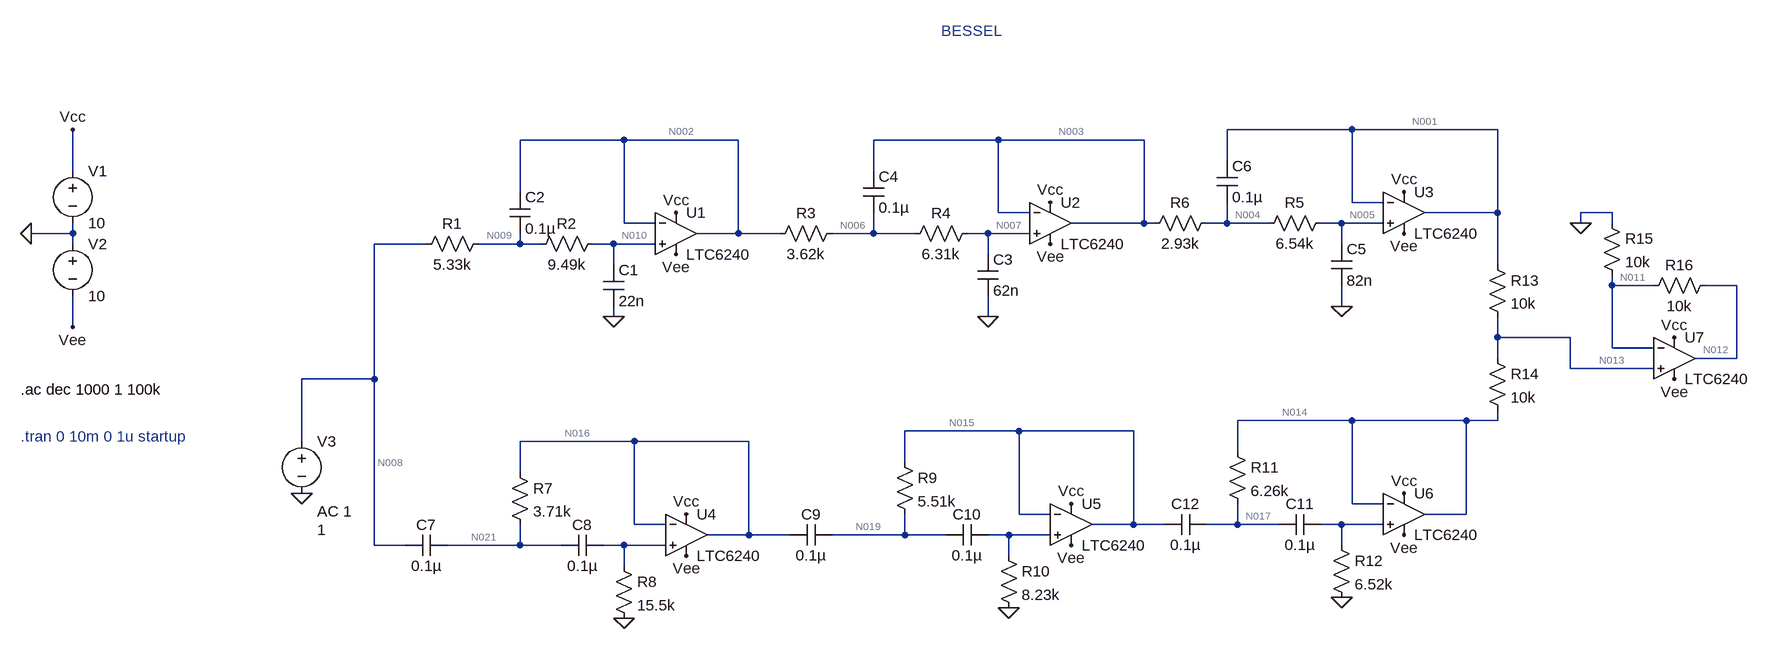
[diagram p0: schematic eq filtering.asc]
eq filtering.asc, the LTspice schematic file:
Version 4
SHEET 1 1800 1780
WIRE 1184 0 992 0
WIRE 1408 0 1184 0
WIRE 64 16 -96 16
WIRE 240 16 64 16
WIRE 640 16 448 16
WIRE 864 16 640 16
WIRE 992 48 992 0
WIRE -784 64 -784 0
WIRE 448 64 448 16
WIRE -96 96 -96 16
WIRE 1184 112 1184 0
WIRE 1232 112 1184 112
WIRE 640 128 640 16
WIRE 688 128 640 128
WIRE 1408 128 1408 0
WIRE 1408 128 1296 128
WIRE 1584 128 1536 128
WIRE 64 144 64 16
WIRE 112 144 64 144
WIRE 864 144 864 16
WIRE 864 144 752 144
WIRE 880 144 864 144
WIRE 992 144 992 112
WIRE 992 144 960 144
WIRE 1056 144 992 144
WIRE 1168 144 1136 144
WIRE 1232 144 1168 144
WIRE 1536 144 1536 128
WIRE 1584 144 1584 128
WIRE -784 160 -784 144
WIRE -784 160 -848 160
WIRE 240 160 240 16
WIRE 240 160 176 160
WIRE 304 160 240 160
WIRE 448 160 448 128
WIRE 448 160 384 160
WIRE 512 160 448 160
WIRE 624 160 592 160
WIRE 688 160 624 160
WIRE -784 176 -784 160
WIRE -240 176 -320 176
WIRE -96 176 -96 160
WIRE -96 176 -160 176
WIRE -64 176 -96 176
WIRE 48 176 16 176
WIRE 112 176 48 176
WIRE 1168 176 1168 144
WIRE 624 192 624 160
WIRE 48 208 48 176
WIRE 1408 208 1408 128
WIRE 1584 240 1584 224
WIRE 1648 240 1584 240
WIRE 1776 240 1728 240
WIRE 1168 272 1168 240
WIRE 48 288 48 272
WIRE 624 288 624 256
WIRE -784 304 -784 256
WIRE 1408 320 1408 288
WIRE 1520 320 1408 320
WIRE 1584 336 1584 240
WIRE 1648 336 1584 336
WIRE 1408 352 1408 320
WIRE 1776 352 1776 240
WIRE 1776 352 1712 352
WIRE 1520 368 1520 320
WIRE 1648 368 1520 368
WIRE -320 384 -320 176
WIRE -320 384 -432 384
WIRE 1184 448 1008 448
WIRE 1360 448 1184 448
WIRE 1408 448 1408 432
WIRE 1408 448 1360 448
WIRE 672 464 496 464
WIRE 848 464 672 464
WIRE -432 480 -432 384
WIRE 80 480 -96 480
WIRE 256 480 80 480
WIRE 1008 496 1008 448
WIRE 496 512 496 464
WIRE -96 528 -96 480
WIRE 1184 576 1184 448
WIRE 1232 576 1184 576
WIRE 672 592 672 464
WIRE 720 592 672 592
WIRE 1360 592 1360 448
WIRE 1360 592 1296 592
WIRE 80 608 80 480
WIRE 128 608 80 608
WIRE 848 608 848 464
WIRE 848 608 784 608
WIRE 896 608 848 608
WIRE 1008 608 1008 576
WIRE 1008 608 960 608
WIRE 1072 608 1008 608
WIRE 1168 608 1136 608
WIRE 1232 608 1168 608
WIRE 256 624 256 480
WIRE 256 624 192 624
WIRE 320 624 256 624
WIRE 496 624 496 592
WIRE 496 624 384 624
WIRE 560 624 496 624
WIRE 656 624 624 624
WIRE 720 624 656 624
WIRE -320 640 -320 384
WIRE -272 640 -320 640
WIRE -96 640 -96 608
WIRE -96 640 -208 640
WIRE -32 640 -96 640
WIRE 64 640 32 640
WIRE 128 640 64 640
WIRE 1168 640 1168 608
WIRE 656 656 656 624
WIRE 64 672 64 640
FLAG -848 160 0
FLAG -784 304 Vee
FLAG -784 0 Vcc
FLAG 144 192 Vee
FLAG 144 128 Vcc
FLAG 48 288 0
FLAG 720 176 Vee
FLAG 720 112 Vcc
FLAG 624 288 0
FLAG 1264 160 Vee
FLAG 1264 96 Vcc
FLAG 1168 272 0
FLAG 160 656 Vee
FLAG 160 592 Vcc
FLAG -432 560 0
FLAG 64 752 0
FLAG 752 640 Vee
FLAG 752 576 Vcc
FLAG 656 736 0
FLAG 1264 624 Vee
FLAG 1264 560 Vcc
FLAG 1168 720 0
FLAG 1680 384 Vee
FLAG 1680 320 Vcc
FLAG 1536 144 0
SYMBOL OpAmps\\LTC6240 144 160 R0
SYMATTR InstName U1
SYMBOL voltage -784 48 R0
WINDOW 123 0 0 Left 0
WINDOW 39 0 0 Left 0
SYMATTR InstName V1
SYMATTR Value 10
SYMBOL voltage -784 160 R0
WINDOW 123 0 0 Left 0
WINDOW 39 0 0 Left 0
SYMATTR InstName V2
SYMATTR Value 10
SYMBOL res -144 160 R90
WINDOW 0 0 56 VBottom 2
WINDOW 3 32 56 VTop 2
SYMATTR InstName R1
SYMATTR Value 5.33k
SYMBOL res 32 160 R90
WINDOW 0 0 56 VBottom 2
WINDOW 3 32 56 VTop 2
SYMATTR InstName R2
SYMATTR Value 9.49k
SYMBOL cap 32 208 R0
SYMATTR InstName C1
SYMATTR Value 22n
SYMBOL cap -112 96 R0
SYMATTR InstName C2
SYMATTR Value 0.1µ
SYMBOL OpAmps\\LTC6240 720 144 R0
SYMATTR InstName U2
SYMBOL res 400 144 R90
WINDOW 0 0 56 VBottom 2
WINDOW 3 32 56 VTop 2
SYMATTR InstName R3
SYMATTR Value 3.62k
SYMBOL res 608 144 R90
WINDOW 0 0 56 VBottom 2
WINDOW 3 32 56 VTop 2
SYMATTR InstName R4
SYMATTR Value 6.31k
SYMBOL cap 608 192 R0
SYMATTR InstName C3
SYMATTR Value 62n
SYMBOL cap 432 64 R0
SYMATTR InstName C4
SYMATTR Value 0.1µ
SYMBOL OpAmps\\LTC6240 1264 128 R0
SYMATTR InstName U3
SYMBOL res 1152 128 R90
WINDOW 0 0 56 VBottom 2
WINDOW 3 32 56 VTop 2
SYMATTR InstName R5
SYMATTR Value 6.54k
SYMBOL cap 1152 176 R0
SYMATTR InstName C5
SYMATTR Value 82n
SYMBOL cap 976 48 R0
SYMATTR InstName C6
SYMATTR Value 0.1µ
SYMBOL res 976 128 R90
WINDOW 0 0 56 VBottom 2
WINDOW 3 32 56 VTop 2
SYMATTR InstName R6
SYMATTR Value 2.93k
SYMBOL OpAmps\\LTC6240 160 624 R0
SYMATTR InstName U4
SYMBOL voltage -432 464 R0
WINDOW 3 24 152 Left 2
WINDOW 123 24 124 Left 2
WINDOW 39 0 0 Left 0
SYMATTR InstName V3
SYMATTR Value 1
SYMATTR Value2 AC 1
SYMBOL cap -208 624 R90
WINDOW 0 0 32 VBottom 2
WINDOW 3 32 32 VTop 2
SYMATTR InstName C7
SYMATTR Value 0.1µ
SYMBOL cap 32 624 R90
WINDOW 0 0 32 VBottom 2
WINDOW 3 32 32 VTop 2
SYMATTR InstName C8
SYMATTR Value 0.1µ
SYMBOL res -112 512 R0
SYMATTR InstName R7
SYMATTR Value 3.71k
SYMBOL res 48 656 R0
SYMATTR InstName R8
SYMATTR Value 15.5k
SYMBOL OpAmps\\LTC6240 752 608 R0
SYMATTR InstName U5
SYMBOL cap 384 608 R90
WINDOW 0 0 32 VBottom 2
WINDOW 3 32 32 VTop 2
SYMATTR InstName C9
SYMATTR Value 0.1µ
SYMBOL cap 624 608 R90
WINDOW 0 0 32 VBottom 2
WINDOW 3 32 32 VTop 2
SYMATTR InstName C10
SYMATTR Value 0.1µ
SYMBOL res 480 496 R0
SYMATTR InstName R9
SYMATTR Value 5.51k
SYMBOL res 640 640 R0
SYMATTR InstName R10
SYMATTR Value 8.23k
SYMBOL OpAmps\\LTC6240 1264 592 R0
SYMATTR InstName U6
SYMBOL cap 1136 592 R90
WINDOW 0 0 32 VBottom 2
WINDOW 3 32 32 VTop 2
SYMATTR InstName C11
SYMATTR Value 0.1µ
SYMBOL res 992 480 R0
SYMATTR InstName R11
SYMATTR Value 6.26k
SYMBOL res 1152 624 R0
SYMATTR InstName R12
SYMATTR Value 6.52k
SYMBOL cap 960 592 R90
WINDOW 0 0 32 VBottom 2
WINDOW 3 32 32 VTop 2
SYMATTR InstName C12
SYMATTR Value 0.1µ
SYMBOL OpAmps\\LTC6240 1680 352 R0
SYMATTR InstName U7
SYMBOL res 1392 192 R0
SYMATTR InstName R13
SYMATTR Value 10k
SYMBOL res 1392 336 R0
SYMATTR InstName R14
SYMATTR Value 10k
SYMBOL res 1568 128 R0
SYMATTR InstName R15
SYMATTR Value 10k
SYMBOL res 1744 224 R90
WINDOW 0 0 56 VBottom 2
WINDOW 3 32 56 VTop 2
SYMATTR InstName R16
SYMATTR Value 10k
TEXT -864 400 Left 2 !.ac dec 1000 1 100k
TEXT 552 -152 Left 2 ;BESSEL
TEXT -864 472 Left 2 ;.tran 0 10m 0 1u startup

The netlist it stands for:
* eq filtering.asc
* U1: LTC6240 (symbol OpAmps\LTC6240 not available, pins judged from their places): In+=N010 In-=N002 V+=Vcc V-=Vee OUT=N002
V1 Vcc 0 10
V2 0 Vee 10
R1 N009 N008 5.33k
R2 N010 N009 9.49k
C1 N010 0 22n
C2 N002 N009 0.1µ
* U2: LTC6240 (symbol OpAmps\LTC6240 not available, pins judged from their places): In+=N007 In-=N003 V+=Vcc V-=Vee OUT=N003
R3 N006 N002 3.62k
R4 N007 N006 6.31k
C3 N007 0 62n
C4 N003 N006 0.1µ
* U3: LTC6240 (symbol OpAmps\LTC6240 not available, pins judged from their places): In+=N005 In-=N001 V+=Vcc V-=Vee OUT=N001
R5 N005 N004 6.54k
C5 N005 0 82n
C6 N001 N004 0.1µ
R6 N004 N003 2.93k
* U4: LTC6240 (symbol OpAmps\LTC6240 not available, pins judged from their places): In+=N022 In-=N016 V+=Vcc V-=Vee OUT=N016
V3 N008 0 1 AC 1
C7 N021 N008 0.1µ
C8 N022 N021 0.1µ
R7 N016 N021 3.71k
R8 N022 0 15.5k
* U5: LTC6240 (symbol OpAmps\LTC6240 not available, pins judged from their places): In+=N020 In-=N015 V+=Vcc V-=Vee OUT=N015
C9 N019 N016 0.1µ
C10 N020 N019 0.1µ
R9 N015 N019 5.51k
R10 N020 0 8.23k
* U6: LTC6240 (symbol OpAmps\LTC6240 not available, pins judged from their places): In+=N018 In-=N014 V+=Vcc V-=Vee OUT=N014
C11 N018 N017 0.1µ
R11 N014 N017 6.26k
R12 N018 0 6.52k
C12 N017 N015 0.1µ
* U7: LTC6240 (symbol OpAmps\LTC6240 not available, pins judged from their places): In+=N013 In-=N011 V+=Vcc V-=Vee OUT=N012
R13 N001 N013 10k
R14 N013 N014 10k
R15 0 N011 10k
R16 N012 N011 10k
.ac dec 1000 1 100k
* BESSEL
* .tran 0 10m 0 1u startup
.backanno
.end

* Results of the author's LTspice run, read from the files saved beside the schematic
* Operating Point, zero values left out:
*   V(n002) = 1 V
*   V(vee) = -10 V
*   V(vcc) = 10 V
*   V(n010) = 1 V
*   V(n009) = 1 V
*   V(n008) = 1 V
*   V(n003) = 1 V
*   V(n007) = 1 V
*   V(n006) = 1 V
*   V(n001) = 1 V
*   V(n005) = 1 V
*   V(n004) = 1 V
*   V(n016) = 44.19 nV
*   V(n021) = 44.19 nV
*   V(n015) = 42.66 nV
*   V(n019) = 42.66 nV
*   V(n014) = 210.7 nV
*   V(n017) = 210.7 nV
*   V(n012) = 1 V
*   V(n013) = 500 mV
*   V(n011) = 500 mV
*   I(R1) = -2.191 pA
*   I(R2) = -2.191 pA
*   I(R3) = -2.191 pA
*   I(R4) = -2.191 pA
*   I(R5) = -2.191 pA
*   I(R6) = -2.191 pA
*   I(R13) = 50 µA
*   I(R14) = 50 µA
*   I(R15) = -50 µA
*   I(R16) = 50 µA
*   I(V1) = -34.54 mA
*   I(V2) = -34.49 mA
*   I(V3) = -2.191 pA